# EAGLE design StickIt-Vga (EAGLE 5.11)
AUTHOR: Dave Vandenbout / XESS Corp.; DIGIKEY#: 742C083222JPCT-ND; JAMECO#: 1952273; MANF: CTS Resistor Products; MANF#: 742C083222JPTR; MOUSER#: 774-742C083222JP; VERSION#: 2.0
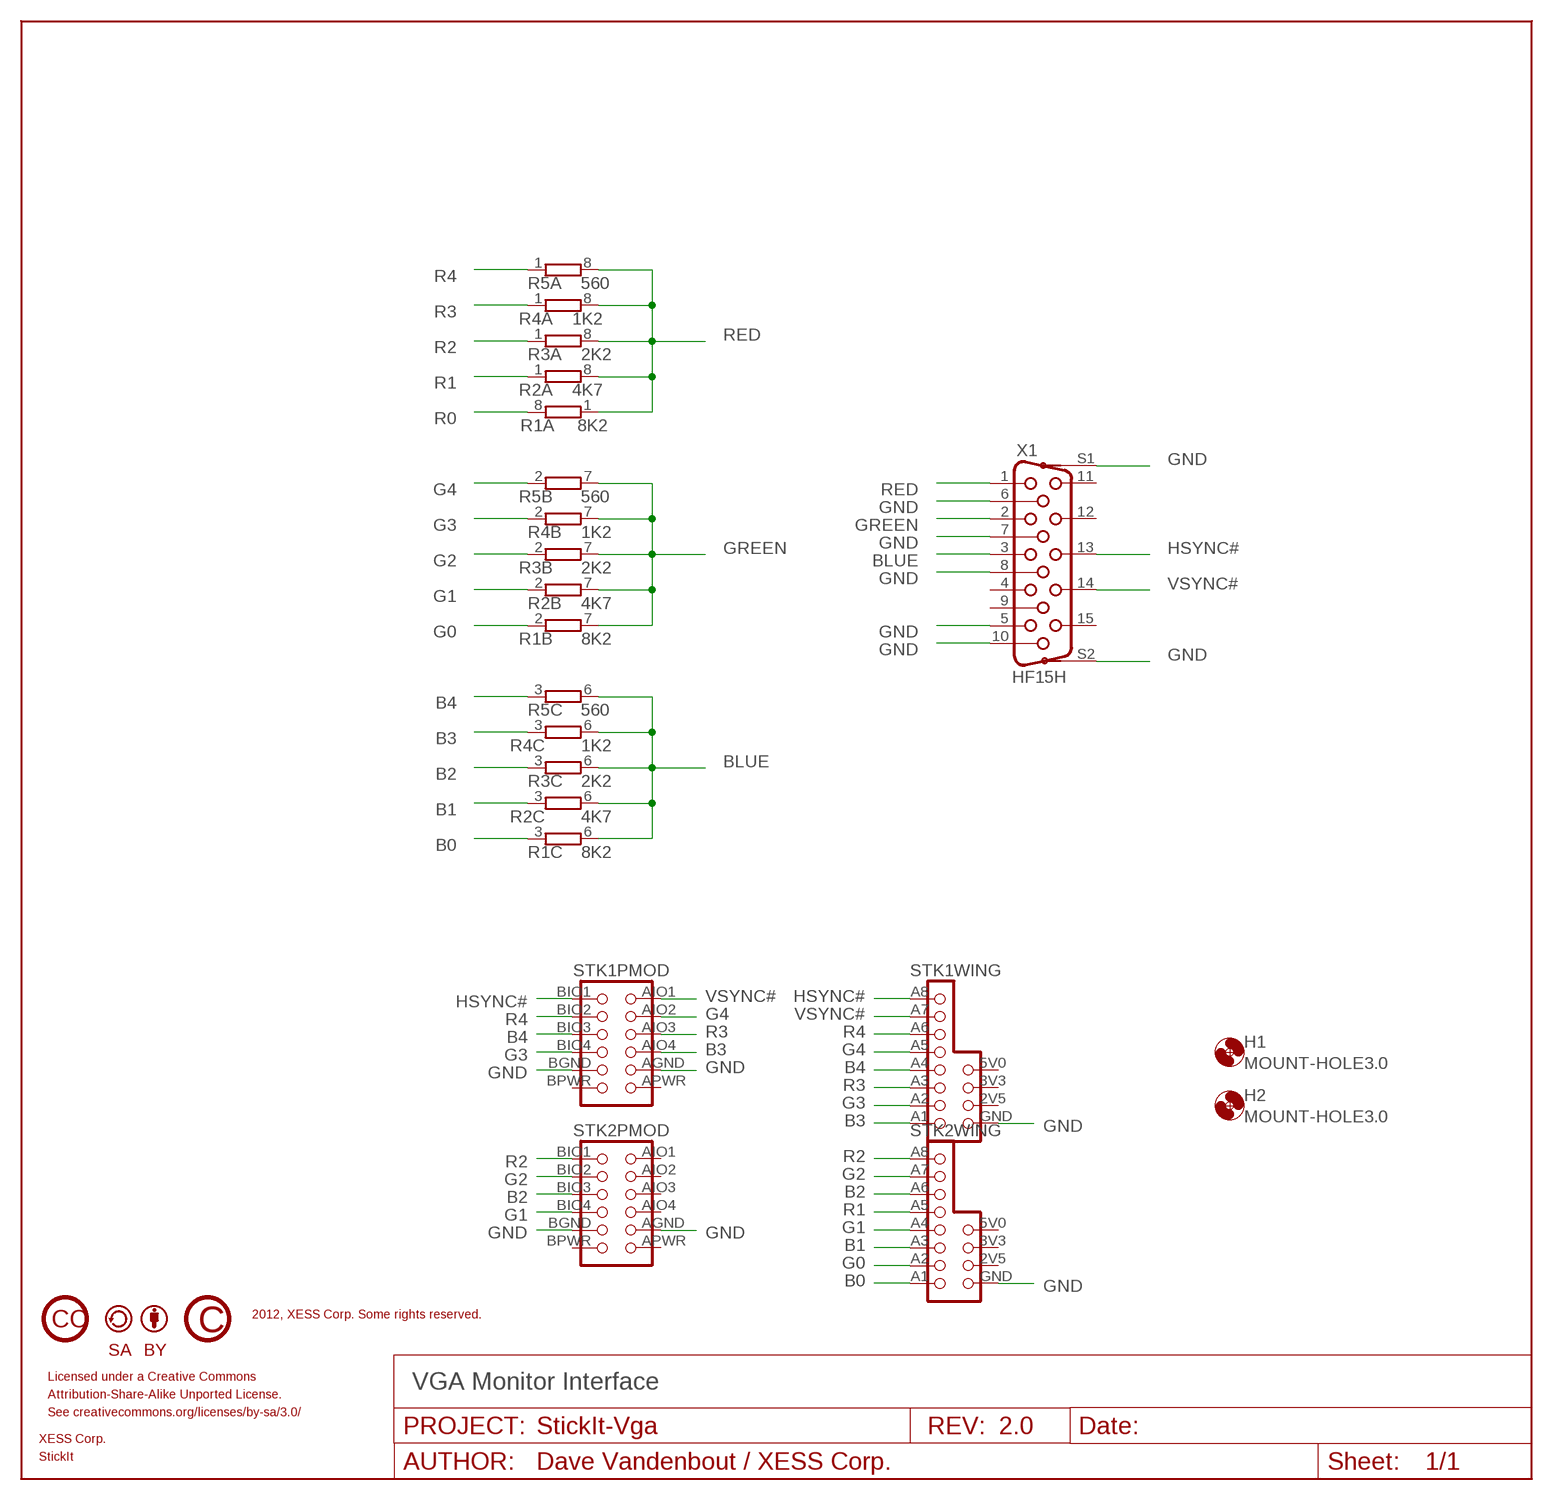
[diagram p0: schematic, sheet 1]

## Parts
H1  MOUNT-HOLE3.0  [3,0]
H2  MOUNT-HOLE3.0  [3,0]
R1  8K2  RES4742  [742C083]
R2  4K7  RES4742  [742C083]
R3  2K2  RES4742  [742C083]
R4  1K2  RES4742  [742C083]
R5  560  RES4742  [742C083]
STK1  STICKIT-HEADER1  [STICKIT-HEADER1]
STK2  STICKIT-HEADER2  [STICKIT-HEADER2]
U$1  CC_CC  [CC_CC]
U$2  CC_SA  [CC_SA]
U$3  CC_BY  [CC_BY]
U$4  CC_COPYRIGHT  [CC_COPYRIGHT]
U$5  LOGO-STICKIT1150X350  [LOGO-STICKIT-1150X350]
U$6  LOGO-XESS900X250  [LOGO-XESS-900X250]
X1  HF15H  [HDF15H]

## Nets
B0: R1.3 STK2.A1(WING:A1)
B1: R2.3 STK2.A3(WING:A3)
B2: R3.3 STK2.A6(WING:A6) STK2.BIO3(PMOD:BIO3)
B3: R4.3 STK1.A1(WING:A1) STK1.AIO4(PMOD:AIO4)
B4: R5.3 STK1.A4(WING:A4) STK1.BIO3(PMOD:BIO3)
BLUE: R1.6 R2.6 R3.6 R4.6 R5.6 X1.3
G0: R1.2 STK2.A2(WING:A2)
G1: R2.2 STK2.A4(WING:A4) STK2.BIO4(PMOD:BIO4)
G2: R3.2 STK2.A7(WING:A7) STK2.BIO2(PMOD:BIO2)
G3: R4.2 STK1.A2(WING:A2) STK1.BIO4(PMOD:BIO4)
G4: R5.2 STK1.A5(WING:A5) STK1.AIO2(PMOD:AIO2)
GND: STK1.AGND(PMOD:AGND) STK1.BGND(PMOD:BGND) STK1.GND(WING:GND) STK2.AGND(PMOD:AGND) STK2.BGND(PMOD:BGND) STK2.GND(WING:GND) X1.5 X1.6 X1.7 X1.8 X1.10 X1.S1 X1.S2
GREEN: R1.7 R2.7 R3.7 R4.7 R5.7 X1.2
HSYNC#: STK1.A8(WING:A8) STK1.BIO1(PMOD:BIO1) X1.13
R0: R1.8
R1: R2.1 STK2.A5(WING:A5)
R2: R3.1 STK2.A8(WING:A8) STK2.BIO1(PMOD:BIO1)
R3: R4.1 STK1.A3(WING:A3) STK1.AIO3(PMOD:AIO3)
R4: R5.1 STK1.A6(WING:A6) STK1.BIO2(PMOD:BIO2)
RED: R1.1 R2.8 R3.8 R4.8 R5.8 X1.1
VSYNC#: STK1.A7(WING:A7) STK1.AIO1(PMOD:AIO1) X1.14
Unconnected: R1.4 R1.5 R2.4 R2.5 R3.4 R3.5 R4.4 R4.5 R5.4 R5.5 STK1.2V5(WING:2V5) STK1.3V3(WING:3V3) STK1.5V0(WING:5V) STK1.APWR(PMOD:APWR) STK1.BPWR(PMOD:BPWR) STK2.2V5(WING:2V5) STK2.3V3(WING:3V3) STK2.5V0(WING:5V) STK2.AIO1(PMOD:AIO1) STK2.AIO2(PMOD:AIO2) STK2.AIO3(PMOD:AIO3) STK2.AIO4(PMOD:AIO4) STK2.APWR(PMOD:APWR) STK2.BPWR(PMOD:BPWR) X1.4 X1.9 X1.11 X1.12 X1.15

## Notes on the sheet
- 2012, XESS Corp. Some rights reserved.
- Licensed under a Creative Commons
- VGA Monitor Interface
- Attribution-Share-Alike Unported License.
- See creativecommons.org/licenses/by-sa/3.0/

## Library data of the parts
H1 H2 = holes:MOUNT-HOLE: MOUNTING HOLE with drill center marker
R1-R5 = xess:RES4: Resistor 4-pack Package of four resistors.; DIGIKEY#: 742C083???JPCT-ND; MANF: CTS Resistor Products; MANF#: 742C083???JPTR; MOUSER#: 774-742C083???JP
STK1 STK2 = xess:STICKIT-HEADER: StickIt Header Combined PMOD and Papilio Wing header for use on StickIt add-on boards.
U$1 = xess:CC_CC
U$2 = xess:CC_SA
U$3 = xess:CC_BY
U$4 = xess:CC_COPYRIGHT
U$5 = xess:LOGO-STICKIT
U$6 = xess:LOGO-XESS
X1 = xess:HF15H: High-density, 15-pin SUB-D connector.; MANF: Kycon; MANF#: K66XHT-E15S-N; MOUSER#: 806-K66XHTE15SNVESA

## Net classes
1 power: clearance 0.254 mm

## Board
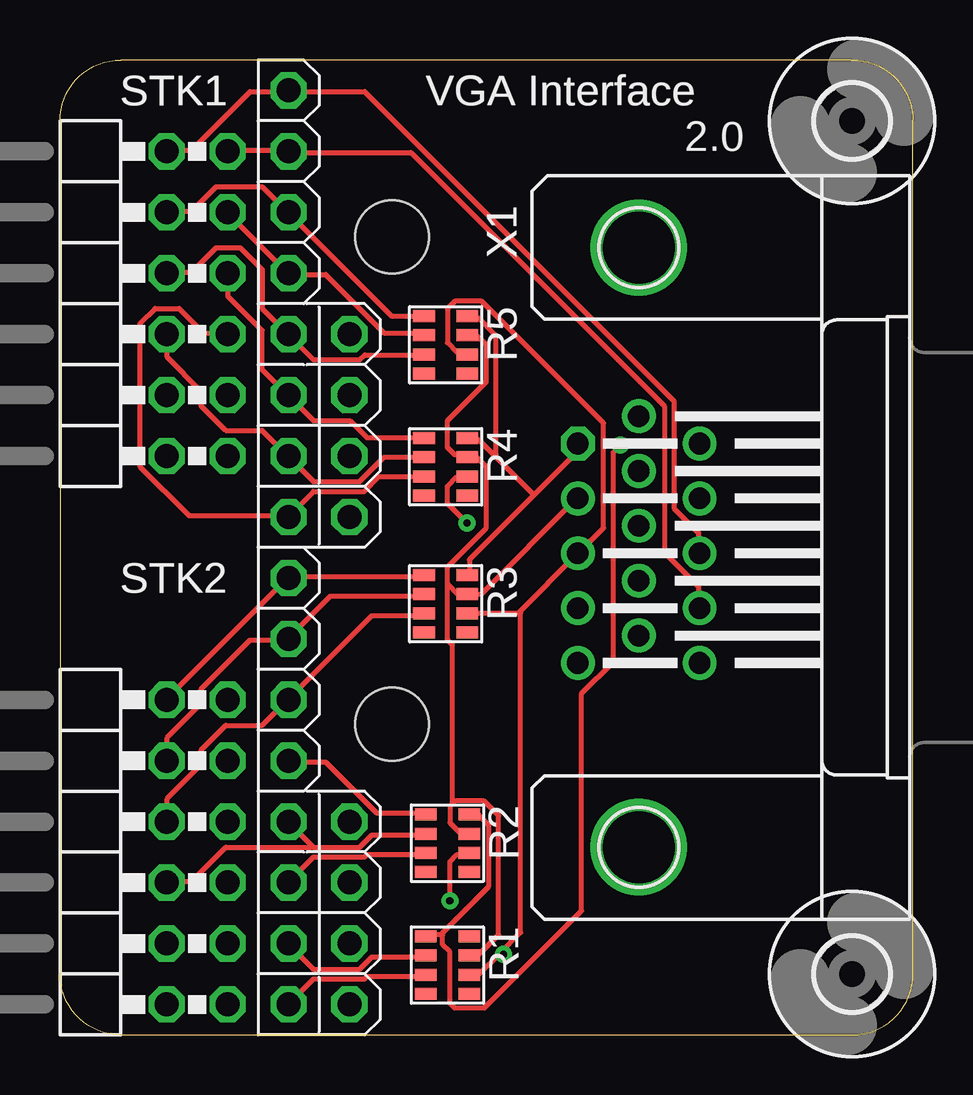
[diagram p1: board, top side]
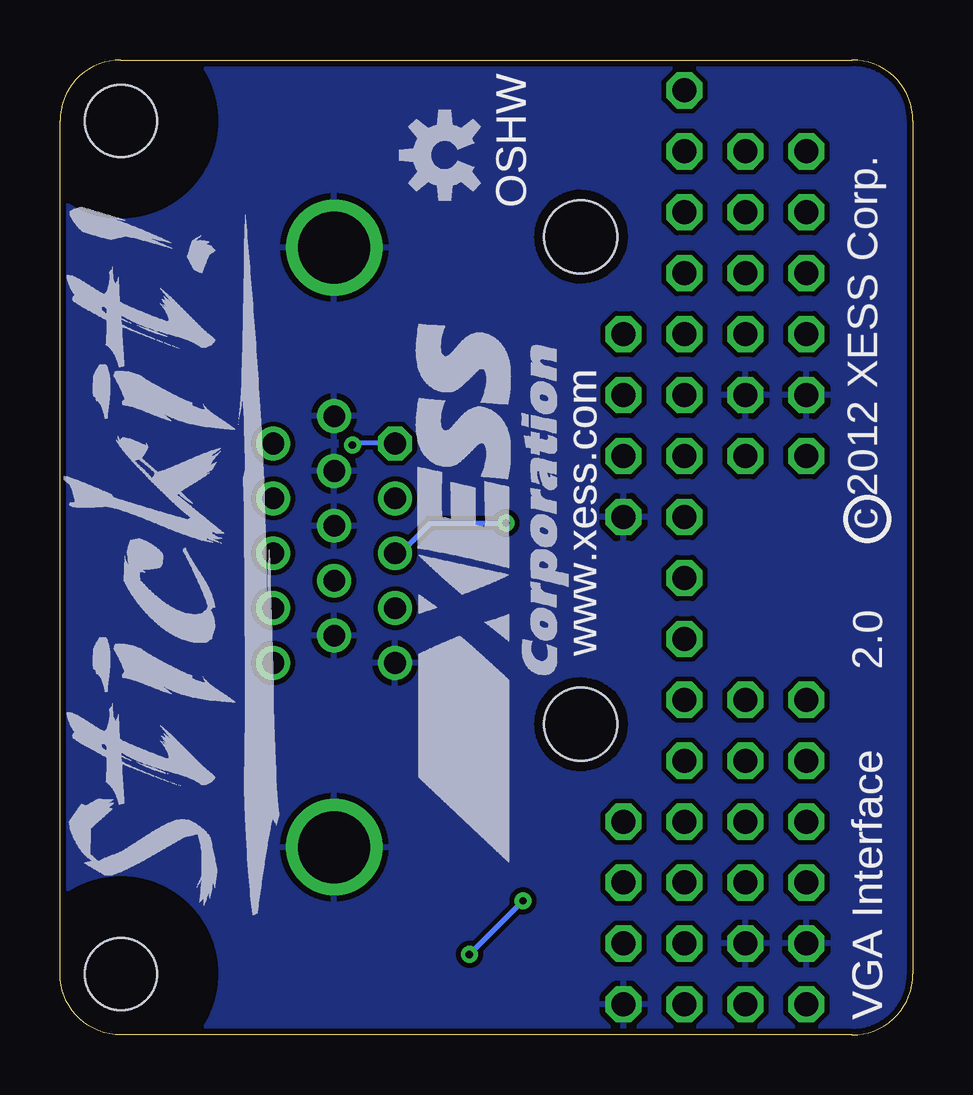
[diagram p2: board, bottom side, seen from below]

Size 35.56 x 40.64 mm. Coordinates in mm from the lower left corner, seen from the top.
Outline: 2.54,0 33.02,0 arc90 35.56,2.54 35.56,38.1 arc90 33.02,40.64 2.54,40.64 arc90 0,38.1 0,2.54 arc90 2.54,0
Copper layers (1*16): Top 0.035mm / dielectric 1.5mm / Bottom 0.035mm
Design rules "ITeadstudio_safe *": minimum track width 8mil, minimum drill 12mil, track to track 8mil, track to pad 8mil, pad to pad 8mil, via to via 8mil, smd to smd 0mil, copper to edge 10mil, drill to drill 10mil, minimum pad ring 10mil, minimum via ring 8mil, stop-mask expansion 2mil, vias tented up to drill 100mil, thermal gap 10mil

### Footprints (pad centres in the part's own frame; a part is rotated, then mirrored left to right if it is on the bottom)
3,0 = hole 3: 0,0
742C083 = smd 0.5 x 0.9: 1 -0.4,-0.9; 2 0.4,-0.9; 3 1.2,-0.9; 4 2,-0.9; 5 2,0.9; 6 1.2,0.9; 7 0.4,0.9; 8 -0.4,0.9
STICKIT-HEADER1 = drill 1 octagon: 2V5 5.08,-15.24; 3V3 5.08,-12.7; 5V0 5.08,-10.16; A1 2.54,-17.78; A2 2.54,-15.24; A3 2.54,-12.7; A4 2.54,-10.16; A5 2.54,-7.62; A6 2.54,-5.08; A7 2.54,-2.54; A8 2.54,0; AGND 0,-12.7; AIO1 0,-2.54; AIO2 0,-5.08; AIO3 0,-7.62; AIO4 0,-10.16; APWR 0,-15.24; BGND -2.54,-12.7; BIO1 -2.54,-2.54; BIO2 -2.54,-5.08; BIO3 -2.54,-7.62; BIO4 -2.54,-10.16; BPWR -2.54,-15.24; GND 5.08,-17.78 | hole 3.048: 6.858,-6.096
STICKIT-HEADER2 = drill 1 octagon: 2V5 5.08,-15.24; 3V3 5.08,-12.7; 5V0 5.08,-10.16; A1 2.54,-17.78; A2 2.54,-15.24; A3 2.54,-12.7; A4 2.54,-10.16; A5 2.54,-7.62; A6 2.54,-5.08; A7 2.54,-2.54; A8 2.54,0; AGND 0,-15.24; AIO1 0,-5.08; AIO2 0,-7.62; AIO3 0,-10.16; AIO4 0,-12.7; APWR 0,-17.78; BGND -2.54,-15.24; BIO1 -2.54,-5.08; BIO2 -2.54,-7.62; BIO3 -2.54,-10.16; BIO4 -2.54,-12.7; BPWR -2.54,-17.78; GND 5.08,-17.78 | hole 3.048: 6.858,-6.096
HDF15H = drill 0.9 octagon: 1 4.329,2.54 | drill 0.9 round: 2 2.043,2.54; 3 -0.243,2.54; 4 -2.529,2.54; 5 -4.815,2.54; 6 5.472,0; 7 3.186,0; 8 0.9,0; 9 -1.386,0; 10 -3.672,0; 11 4.329,-2.54; 12 2.043,-2.54; 13 -0.243,-2.54; 14 -2.529,-2.54; 15 -4.815,-2.54 | drill 3 round: S1 -12.499,0; S2 12.499,0

### Placement (x,y rotation side)
H1  33.02,38.1 0 top
H2  33.02,2.54 0 top
R1  16.15,3.71 270 top
R2  16.15,8.79 270 top
R3  16.08,18.77 270 top
R4  16.08,24.49 270 top
R5  16.08,29.57 270 top
STK1  6.99,39.37 0 top
STK2  6.99,19.05 0 top
U$1  -5.08,-12.7 0 top  (outside the outline)
U$2  0.64,-12.7 0 top  (outside the outline)
U$3  5.08,-12.7 0 top  (outside the outline)
U$4  -5.08,-5.08 0 top  (outside the outline)
U$5  27.52,5.05 90 bottom
U$6  16.73,7.23 90 bottom
X1  24.13,20.32 90 top

### Tracks (layer width: path | path; a pad name or v marks a point on that pad's centre or on a via)
B0
  Top 0.203: R1.3 15.24,2.44 12.8,2.44 12.7,2.34 10.57,2.34 9.55,1.32 STK2.A1
B1
  Top 0.203: R2.3 15.24,7.52 12.8,7.52 12.7,7.42 10.57,7.42 9.55,6.4 STK2.A3
B2
  Top 0.203: R3.3 15.14,17.48 13.01,17.48 9.55,14.02 STK2.A6 9.45,13.92 8.43,12.9 6.91,12.9 5.89,11.89 5.89,11.28 4.47,9.86 4.47,8.94 STK2.BIO3
B3
  Top 0.203: R4.3 15.14,23.27 13.31,23.27 12.7,22.66 10.57,22.66 9.55,21.64 STK1.A1 9.45,21.64 5.38,21.64 3.35,23.67 3.35,29.67 3.96,30.28 4.98,30.28 5.99,29.26 6.91,29.26 STK1.AIO4
B4
  Top 0.203: R5.3 15.14,28.35 12.7,28.35 12.5,28.14 10.57,28.14 9.55,29.16 STK1.A4 9.45,29.26 8.43,30.28 8.43,31.9 7.52,32.82 6.5,32.82 5.49,31.8 4.47,31.8 STK1.BIO3
BLUE  (via drill 0.3)
  Top 0.203: 19.15,17.63 21.54,20.02 X1.3 21.64,20.12 22.66,21.13 22.66,25.5 17.58,30.58 16.46,30.58 16.15,30.28 16.15,28.85 16.56,28.45 16.97,28.45 R5.6 | 19.15,17.63 19.1,17.58 17.07,17.58 R3.6 | v16.97,21.34 16.15,22.15 16.15,22.86 16.56,23.27 16.97,23.27 R4.6 | 18.34,3.4 19.2,4.27 19.2,17.58 19.15,17.63 | 18.34,3.4 17.48,2.54 17.07,2.54 R1.6 | v16.26,5.59 16.26,7.21 16.56,7.52 16.97,7.52 R2.6 | v18.49,3.35 18.39,3.35 18.34,3.4
  Bottom 0.203: v16.97,21.34 20.12,21.34 21.34,20.12 21.54,20.12 X1.3 | v18.49,3.35 v16.26,5.59
G0
  Top 0.203: R1.2 15.24,3.25 13.01,3.25 12.5,2.74 10.57,2.74 9.55,3.76 STK2.A2
G1
  Top 0.203: 10.52,7.87 9.55,8.84 STK2.A4 | 10.52,7.87 10.57,7.82 12.5,7.82 13.01,8.33 15.24,8.33 R2.2 | STK2.BIO4 4.47,6.4 5.49,6.4 6.91,7.82 10.46,7.82 10.52,7.87
G2
  Top 0.203: R3.2 15.14,18.29 11.28,18.29 9.55,16.56 STK2.A7 9.45,16.46 7.92,16.46 5.89,14.43 5.89,13.82 4.47,12.39 4.47,11.48 STK2.BIO2
G3
  Top 0.203: R4.2 15.14,24.08 13.51,24.08 12.5,23.06 10.57,23.06 9.55,24.08 STK1.A2 9.45,24.18 8.43,25.2 6.91,25.2 5.89,26.21 5.89,26.82 4.47,28.25 4.47,29.16 STK1.BIO4
G4
  Top 0.203: R5.2 15.14,29.26 13.51,29.26 11.07,31.7 9.55,31.7 STK1.A5 9.45,31.8 7.01,34.24 STK1.AIO2
GND
  pour Bottom: 0,40.64 35.56,40.64 35.56,0 0,0
GREEN
  Top 0.203: 16.41,9.7 16.26,9.55 16.26,8.84 16.66,8.43 16.97,8.43 R2.7 | 16.41,9.7 16.46,9.75 17.68,9.75 18.29,9.14 18.29,4.17 17.48,3.35 17.07,3.35 R1.7 | R5.7 17.07,29.16 17.37,29.16 17.78,28.75 17.78,27.23 16.15,25.6 16.15,24.49 16.46,24.18 16.97,24.18 R4.7 17.07,24.08 17.37,24.08 17.78,23.67 17.78,21.13 16.15,19.51 16.15,18.8 16.2,18.75 | X1.2 21.54,22.35 17.58,18.39 17.07,18.39 R3.7 16.97,18.39 16.56,18.39 16.2,18.75 | 16.41,9.7 16.36,9.75 16.36,16.26 16.15,16.46 16.15,18.69 16.2,18.75
HSYNC#
  Top 0.203: X1.13 26.62,20.12 26.62,20.93 25.6,21.95 25.6,26.42 12.7,39.32 9.55,39.32 STK1.A8 9.45,39.32 7.92,39.32 5.49,36.88 4.47,36.88 STK1.BIO1
R1
  Top 0.203: R2.1 15.24,9.25 13.21,9.25 11.07,11.38 9.55,11.38 STK2.A5
R2
  Top 0.203: R3.1 15.14,19.1 9.55,19.1 STK2.A8 9.45,19 4.47,14.02 STK2.BIO1
R3
  Top 0.203: R4.1 15.14,24.89 12.8,24.89 12.09,25.6 10.57,25.6 9.55,26.62 STK1.A3 9.45,26.72 8.43,27.74 8.43,29.36 7.01,30.79 7.01,31.7 STK1.AIO3
R4
  Top 0.203: R5.1 15.14,29.97 13.82,29.97 9.55,34.24 STK1.A6 9.45,34.34 8.43,35.36 6.5,35.36 5.49,34.34 4.47,34.34 STK1.BIO2
RED  (via drill 0.3)
  Top 0.203: 15.9,4.22 17.88,6.2 17.88,8.74 17.48,9.14 17.07,9.14 R2.8 | 15.9,4.22 15.85,4.17 15.34,4.17 R1.1 | 19.76,22.5 21.54,24.28 21.54,24.59 X1.1 | 19.76,22.5 17.07,19.81 17.07,19.2 R3.8 | 18.14,24.13 17.48,24.79 17.07,24.79 R4.8 | 19.76,22.5 18.14,24.13 | R5.8 17.07,29.87 17.48,29.87 18.19,29.16 18.19,24.18 18.14,24.13 | v23.37,24.59 23.06,24.28 23.06,15.54 21.74,14.22 21.74,5.18 17.68,1.12 16.46,1.12 16.26,1.32 16.26,3.45 15.95,3.76 15.95,4.17 15.9,4.22
  Bottom 0.203: v23.37,24.59 23.27,24.69 21.64,24.69 X1.1
VSYNC#
  Top 0.203: X1.14 26.62,17.88 26.62,18.69 25.2,20.12 25.2,26.21 14.63,36.78 9.55,36.78 STK1.A7 9.45,36.88 7.01,36.88 STK1.AIO1

### Text on the board
tPlace: VGA Interface
bPlace: OSHW | www.xess.com | VGA Interface
tDocu: 2012, XESS Corp. Some rights reserved. | Licensed under a Creative Commons | Attribution-Share-Alike Unported License. | See creativecommons.org/licenses/by-sa/3.0/
_tPlace: VGA Interface | 2.0
_bPlace: OSHW | c 2012 XESS Corp. | www.xess.com | 2.0 | VGA Interface
_tNames: STK1 | X1 | R5 | R4 | STK2 | R3 | R2 | R1
_tValues: HF15H
_tDocu: 6 | 1 | 11 | Female | HDF15 CONEC | 5 | 10 | 15 | 2012, XESS Corp. Some rights reserved. | C | Licensed under a Creative Commons | Attribution-Share-Alike Unported License. | CC | See creativecommons.org/licenses/by-sa/3.0/ | SA | BY